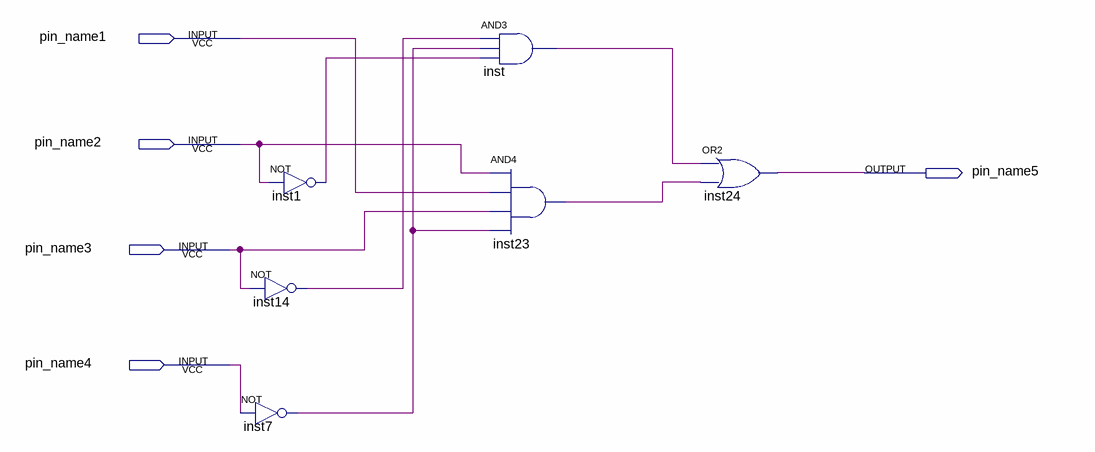
[diagram p0: schematic sheet]
// Quartus schematic g (2022_05_22 18_19_10 UTC).bdf as structural Verilog: 6 symbols, 5 pins
module \g_(2022_05_22_18_19_10_UTC)  (
  input  pin_name1,
  input  pin_name2,
  input  pin_name3,
  input  pin_name4,
  output pin_name5
);

  wire inst1_out, inst7_out, inst14_out, inst23_out, inst_out;

  not inst14 (inst14_out, pin_name3);
  not inst7 (inst7_out, pin_name4);
  not inst1 (inst1_out, pin_name2);
  and inst (inst_out, inst14_out, inst7_out, inst1_out);
  and inst23 (inst23_out, pin_name2, pin_name1, pin_name3, inst7_out);
  or inst24 (pin_name5, inst_out, inst23_out);
endmodule
